# EasyEDA schematic SCH_lipo_for_purrcat_2023-10-06.json
TITLE: Sheet_1; REV: 1.0; Date: 2023-02-17; Sheet: 1/1; Drawn By: G; Company: Your Company
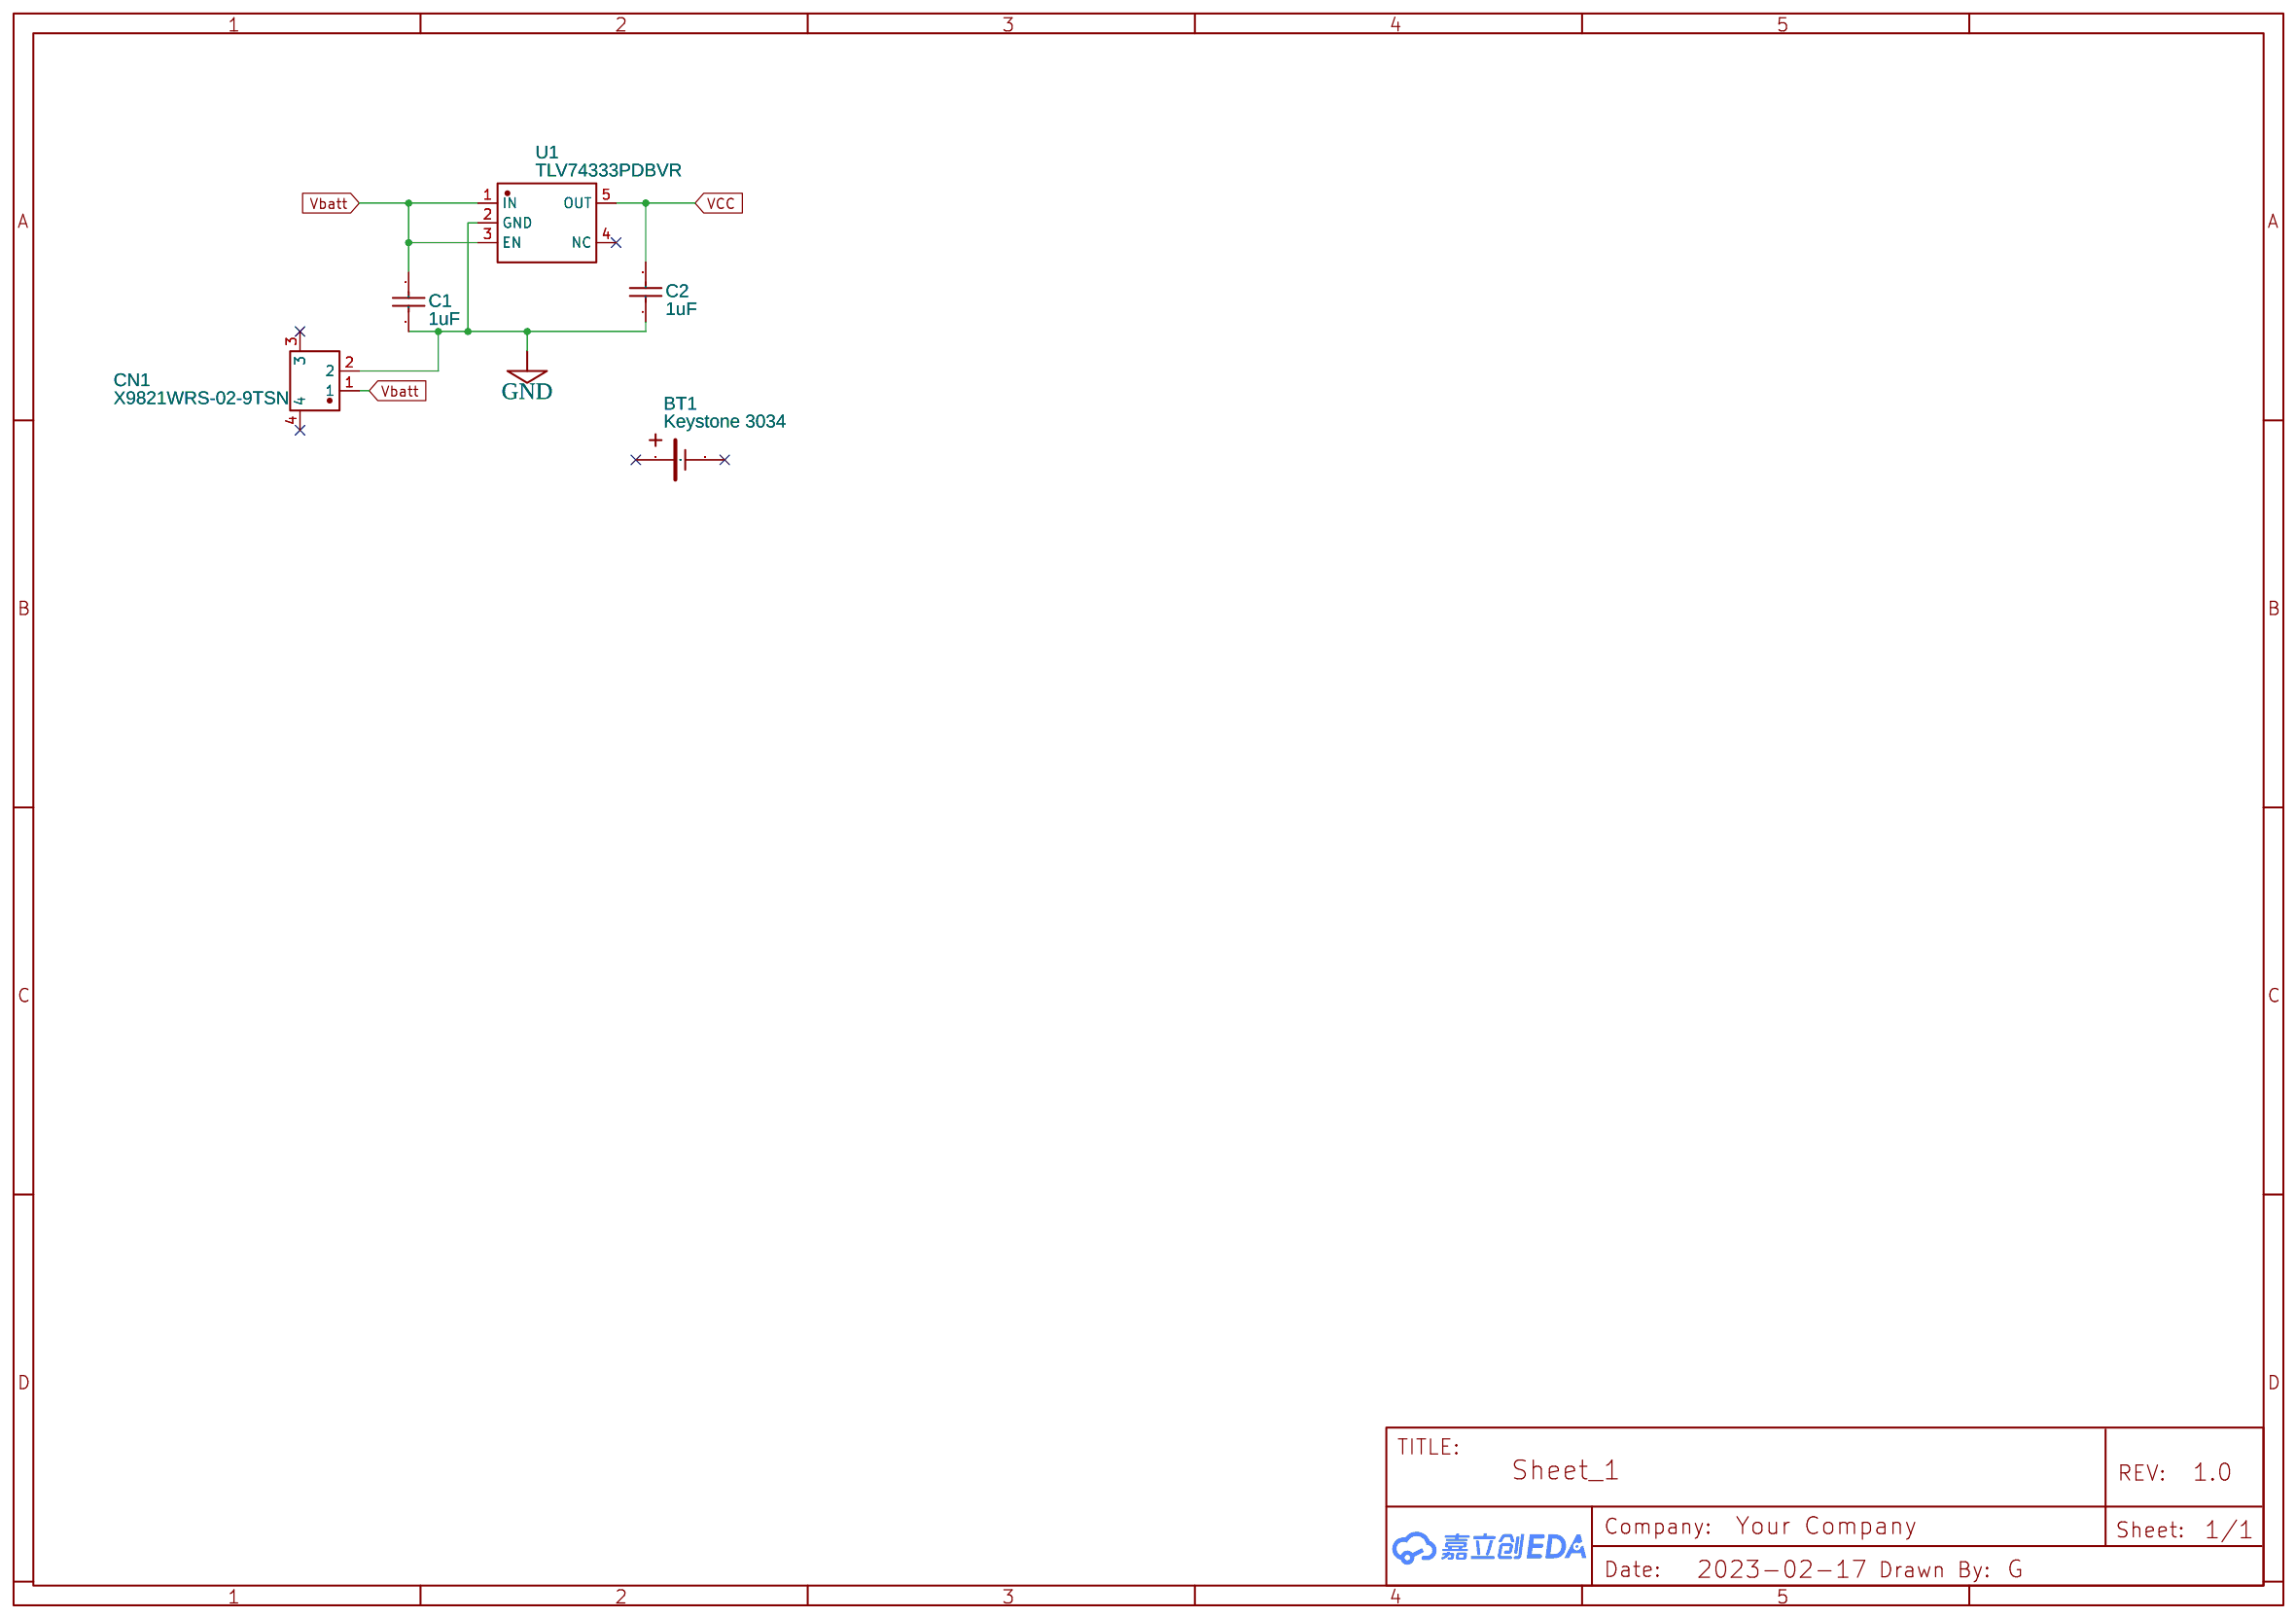
[diagram p0: schematic sheet]

## Parts
BT1  Keystone 3034  [KEYSTONE_3034]
C1  1uF  [C0603]
C2  1uF  [C0603]
CN1  X9821WRS-02-9TSN  [CONN-SMD_2P-P1.25_X9821WRS-02-9TSN]
U1  TLV74333PDBVR  [SOT-23-5_L3.0-W1.7-P0.95-LS2.8-BR]

## Library data of the parts
BT1 = Keystone 3034: Manufacturer: Keystone Electronics; Manufacturer Part: 3034; Supplier Part: 534-3034; link: https://eu.mouser.com/datasheet/2/215/3034-743109.pdf; Contributor: Draxter
C1 C2 = CL10B105KO8NNNC: Supplier: LCSC; Manufacturer: SAMSUNG(三星); Supplier Part: C59782; JLCPCB Part Class: Extended Part
CN1 = X9821WRS-02-9TSN: Supplier: LCSC; Supplier Part: C397377; Manufacturer: XKB Connectivity(中国星坤); Contributor: LCSC; JLCPCB Part Class: Extended Part
U1 = TLV74333PDBVR: Supplier: LCSC; Supplier Part: C408972; Manufacturer: TI(德州仪器); Contributor: LCSC; JLCPCB Part Class: Extended Part

## Nets
GND: C1.2 C2.2 CN1.2 U1.2(GND)
Vbatt: C1.1 CN1.1 U1.1(IN) U1.3(EN)
VCC: C2.1 U1.5(OUT)

Not connected (* = marked no-connect by the designer): BT1 1* 2*; CN1 3* 4*; U1 4(NC)*
